# EAGLE schematic T-ShirtPress Schematic (EAGLE 9.5.2)
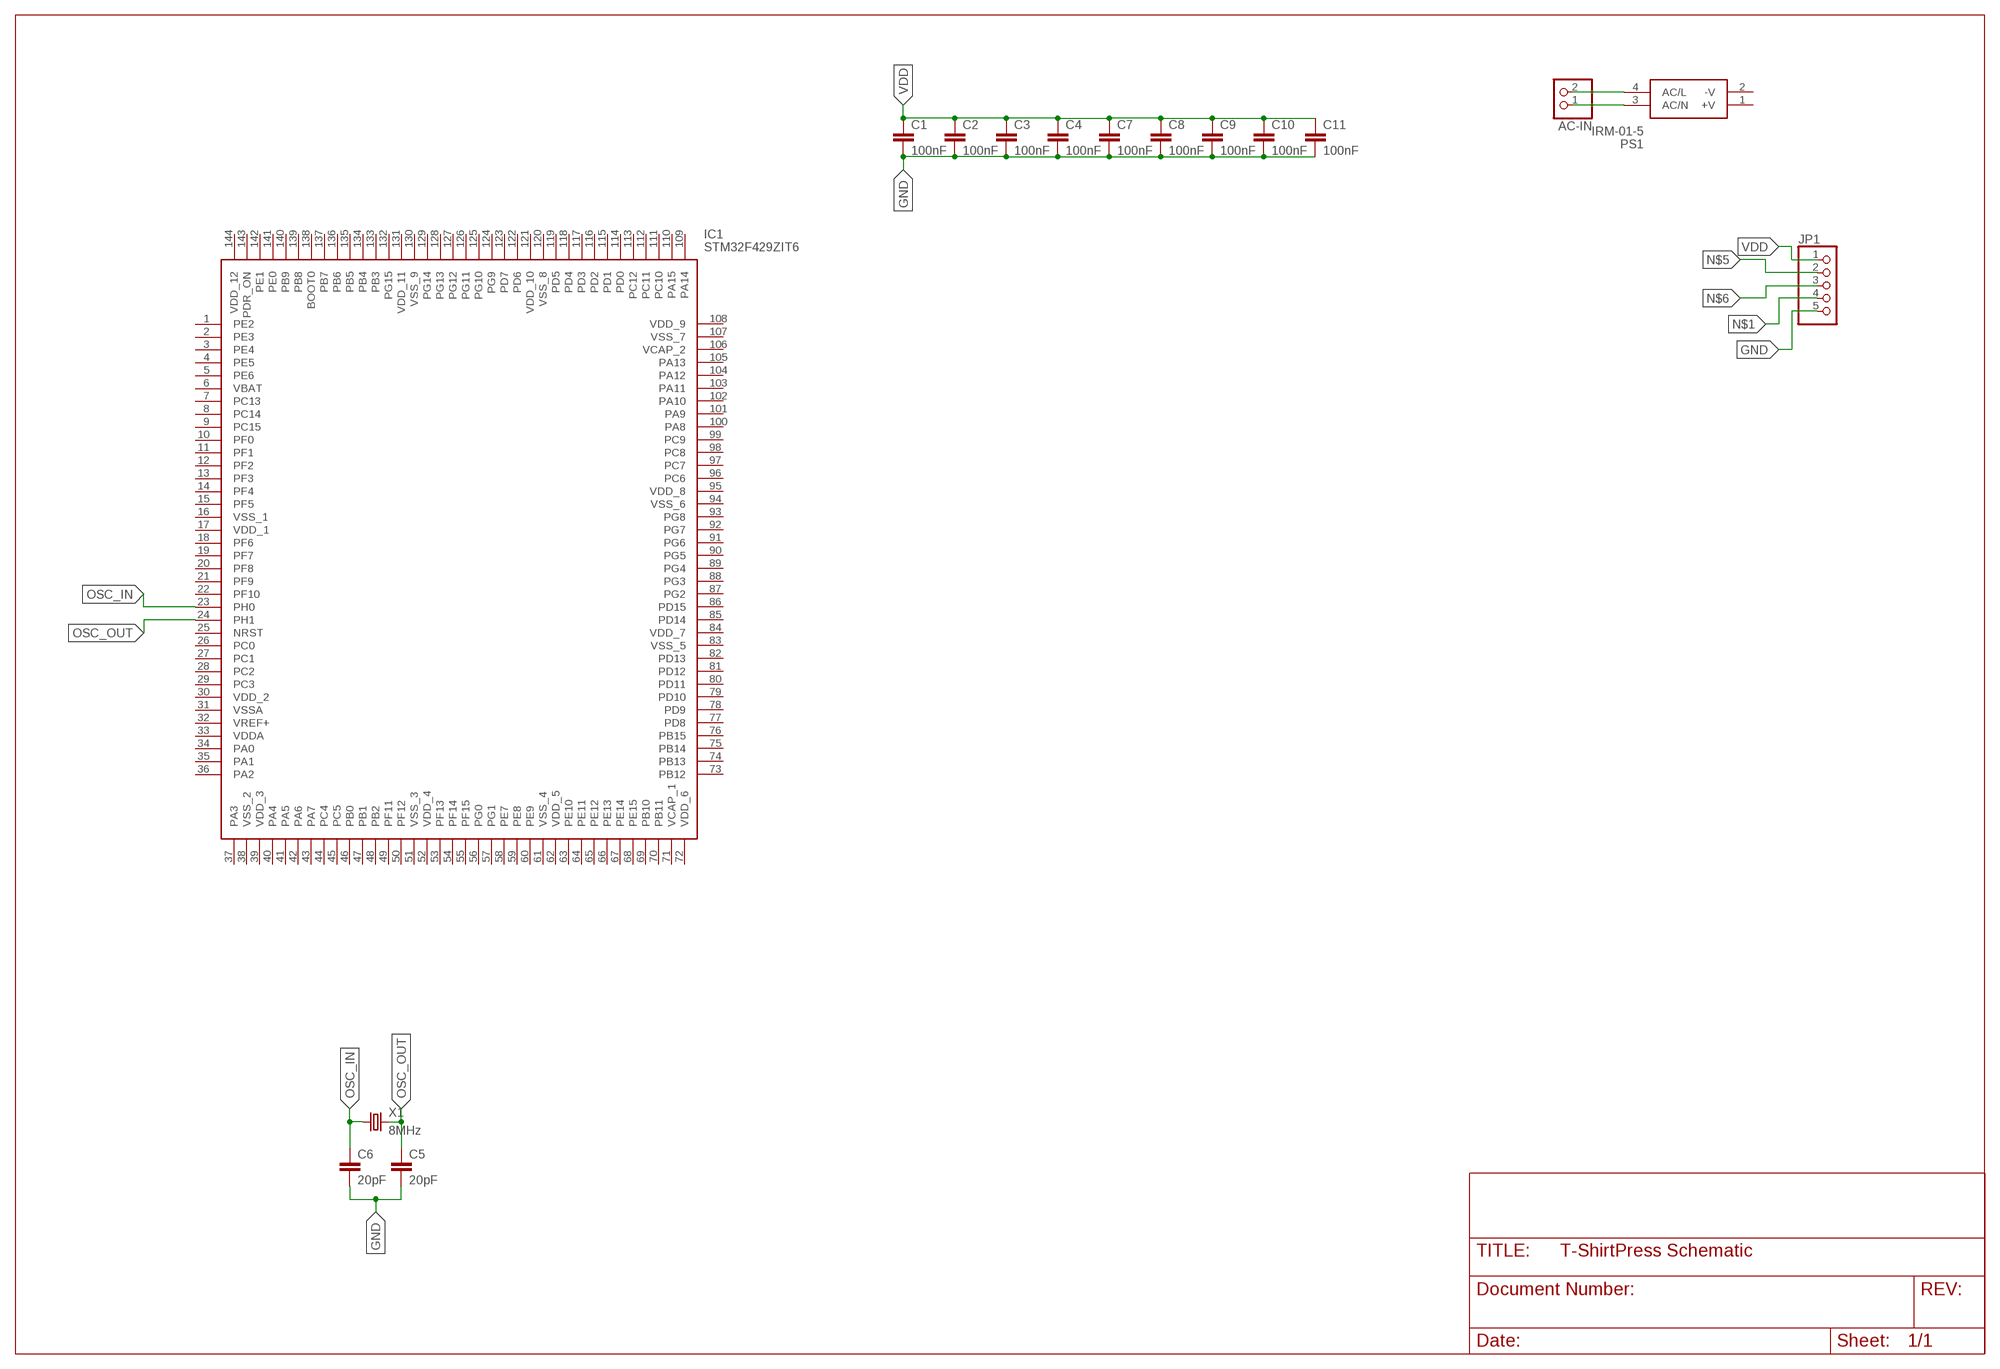
[diagram p0: schematic, sheet 1]

## Parts
AC-IN  PINHD-1X2  [1X02]
C1  100nF  C-EUC1206  [C1206]
C2  100nF  C-EUC1206  [C1206]
C3  100nF  C-EUC1206  [C1206]
C4  100nF  C-EUC1206  [C1206]
C5  20pF  C-EUC1206  [C1206]
C6  20pF  C-EUC1206  [C1206]
C7  100nF  C-EUC1206  [C1206]
C8  100nF  C-EUC1206  [C1206]
C9  100nF  C-EUC1206  [C1206]
C10  100nF  C-EUC1206  [C1206]
C11  100nF  C-EUC1206  [C1206]
IC1  STM32F429ZIT6  [QFP50P2200X2200X160-144N]
JP1  PINHD-1X5  [1X05]
PS1  IRM-01-5  [IRM015]
X1  8MHz  CRYSTALHC49S  [HC49/S]

## Nets
GND: C1.2 C2.2 C3.2 C4.2 C5.2 C6.2 C7.2 C8.2 C9.2 C10.2 C11.2 JP1.5
N$1: JP1.4
N$5: JP1.2
N$6: JP1.3
OSC_IN: C6.1 IC1.23(PH0) X1.1
OSC_OUT: C5.1 IC1.24(PH1) X1.2
VDD: C1.1 C2.1 C3.1 C4.1 C7.1 C8.1 C9.1 C10.1 C11.1 JP1.1
VLINE: AC-IN.2 PS1.4(AC/L)
VNEUTRAL: AC-IN.1 PS1.3(AC/N)
Unconnected: IC1.1(PE2) IC1.2(PE3) IC1.3(PE4) IC1.4(PE5) IC1.5(PE6) IC1.6(VBAT) IC1.7(PC13) IC1.8(PC14) IC1.9(PC15) IC1.10(PF0) IC1.11(PF1) IC1.12(PF2) IC1.13(PF3) IC1.14(PF4) IC1.15(PF5) IC1.18(PF6) IC1.19(PF7) IC1.20(PF8) IC1.21(PF9) IC1.22(PF10) IC1.25(NRST) IC1.26(PC0) IC1.27(PC1) IC1.28(PC2) IC1.29(PC3) IC1.32(VREF+) IC1.34(PA0) IC1.35(PA1) IC1.36(PA2) IC1.37(PA3) IC1.40(PA4) IC1.41(PA5) IC1.42(PA6) IC1.43(PA7) IC1.44(PC4) IC1.45(PC5) IC1.46(PB0) IC1.47(PB1) IC1.48(PB2) IC1.49(PF11) IC1.50(PF12) IC1.53(PF13) IC1.54(PF14) IC1.55(PF15) IC1.56(PG0) IC1.57(PG1) IC1.58(PE7) IC1.59(PE8) IC1.60(PE9) IC1.63(PE10) IC1.64(PE11) IC1.65(PE12) IC1.66(PE13) IC1.67(PE14) IC1.68(PE15) IC1.69(PB10) IC1.70(PB11) IC1.71(VCAP_1) IC1.73(PB12) IC1.74(PB13) IC1.75(PB14) IC1.76(PB15) IC1.77(PD8) IC1.78(PD9) IC1.79(PD10) IC1.80(PD11) IC1.81(PD12) IC1.82(PD13) IC1.85(PD14) IC1.86(PD15) IC1.87(PG2) IC1.88(PG3) IC1.89(PG4) IC1.90(PG5) IC1.91(PG6) IC1.92(PG7) IC1.93(PG8) IC1.96(PC6) IC1.97(PC7) IC1.98(PC8) IC1.99(PC9) IC1.100(PA8) IC1.101(PA9) IC1.102(PA10) IC1.103(PA11) IC1.104(PA12) IC1.105(PA13) IC1.106(VCAP_2) IC1.109(PA14) IC1.110(PA15) IC1.111(PC10) IC1.112(PC11) IC1.113(PC12) IC1.114(PD0) IC1.115(PD1) IC1.116(PD2) IC1.117(PD3) IC1.118(PD4) IC1.119(PD5) IC1.122(PD6) IC1.123(PD7) IC1.124(PG9) IC1.125(PG10) IC1.126(PG11) IC1.127(PG12) IC1.128(PG13) IC1.129(PG14) IC1.132(PG15) IC1.133(PB3) IC1.134(PB4) IC1.135(PB5) IC1.136(PB6) IC1.137(PB7) IC1.138(BOOT0) IC1.139(PB8) IC1.140(PB9) IC1.141(PE0) IC1.142(PE1) IC1.143(PDR_ON) PS1.1(+V) PS1.2(-V)

## Power pins joined to a net without a drawn wire
VDD_1: IC1.17(VDD_1)
VDD_2: IC1.30(VDD_2)
VDD_3: IC1.39(VDD_3)
VDD_4: IC1.52(VDD_4)
VDD_5: IC1.62(VDD_5)
VDD_6: IC1.72(VDD_6)
VDD_7: IC1.84(VDD_7)
VDD_8: IC1.95(VDD_8)
VDD_9: IC1.108(VDD_9)
VDD_10: IC1.121(VDD_10)
VDD_11: IC1.131(VDD_11)
VDD_12: IC1.144(VDD_12)
VDDA: IC1.33(VDDA)
VSS_1: IC1.16(VSS_1)
VSS_2: IC1.38(VSS_2)
VSS_3: IC1.51(VSS_3)
VSS_4: IC1.61(VSS_4)
VSS_5: IC1.83(VSS_5)
VSS_6: IC1.94(VSS_6)
VSS_7: IC1.107(VSS_7)
VSS_8: IC1.120(VSS_8)
VSS_9: IC1.130(VSS_9)
VSSA: IC1.31(VSSA)

## Library data of the parts
AC-IN = pinhead:PINHD-1X2: PIN HEADER
C1-C11 = rcl:C-EU: CAPACITOR, European symbol; SPICEPREFIX: C
IC1 = SamacSys_Parts:STM32F429ZIT6: 32-Bit MCU+FPU M4 2MB LCD-TFT LQFP144 STMicroelectronics STM32F429ZIT6, 32bit ARM Cortex M4 MCU, 180MHz, 2048 kB Flash, 144-Pin LQFP Source: Datasheet <http://www.st.com/web/en/resource/technical/document/datasheet/DM00071990.pdf>; ALLIED_NUMBER: 70391114; ALLIED_PRICE-STOCK: http://www.alliedelec.com/stmicroelectronics-stm32f429zit6/70391114/; DESCRIPTION: 32-Bit MCU+FPU M4 2MB LCD-TFT LQFP144 STMicroelectronics STM32F429ZIT6, 32bit ARM Cortex M4 MCU, 180MHz, 2048 kB Flash, 144-Pin LQFP; HEIGHT: 1.6mm; MANUFACTURER_NAME: STMicroelectronics; MANUFACTURER_PART_NUMBER: STM32F429ZIT6; MOUSER_PART_NUMBER: 511-STM32F429ZIT6; MOUSER_PRICE-STOCK: https://www.mouser.com/Search/Refine.aspx?Keyword=511-STM32F429ZIT6; RS_PART_NUMBER: 7926053P; RS_PRICE-STOCK: http://uk.rs-online.com/web/p/products/7926053P
JP1 = pinhead:PINHD-1X5: PIN HEADER
PS1 = SamacSys_Parts:IRM-01-5: Power Supply Encapsulated PCB 5V 1W Source: Datasheet <https://www.meanwell.com/Upload/PDF/IRM-01/IRM-01-SPEC.PDF>; DESCRIPTION: Power Supply Encapsulated PCB 5V 1W; HEIGHT: 15mm; MANUFACTURER_NAME: Mean Well; MANUFACTURER_PART_NUMBER: IRM-01-5; MOUSER_PART_NUMBER: 709-IRM01-5; MOUSER_PRICE-STOCK: https://www.mouser.com/Search/Refine.aspx?Keyword=709-IRM01-5
X1 = crystal:CRYSTAL: CRYSTAL; OC_FARNELL: 1667008; OC_NEWARK: unknown